# Altium project PTXC8S2.PrjPcb
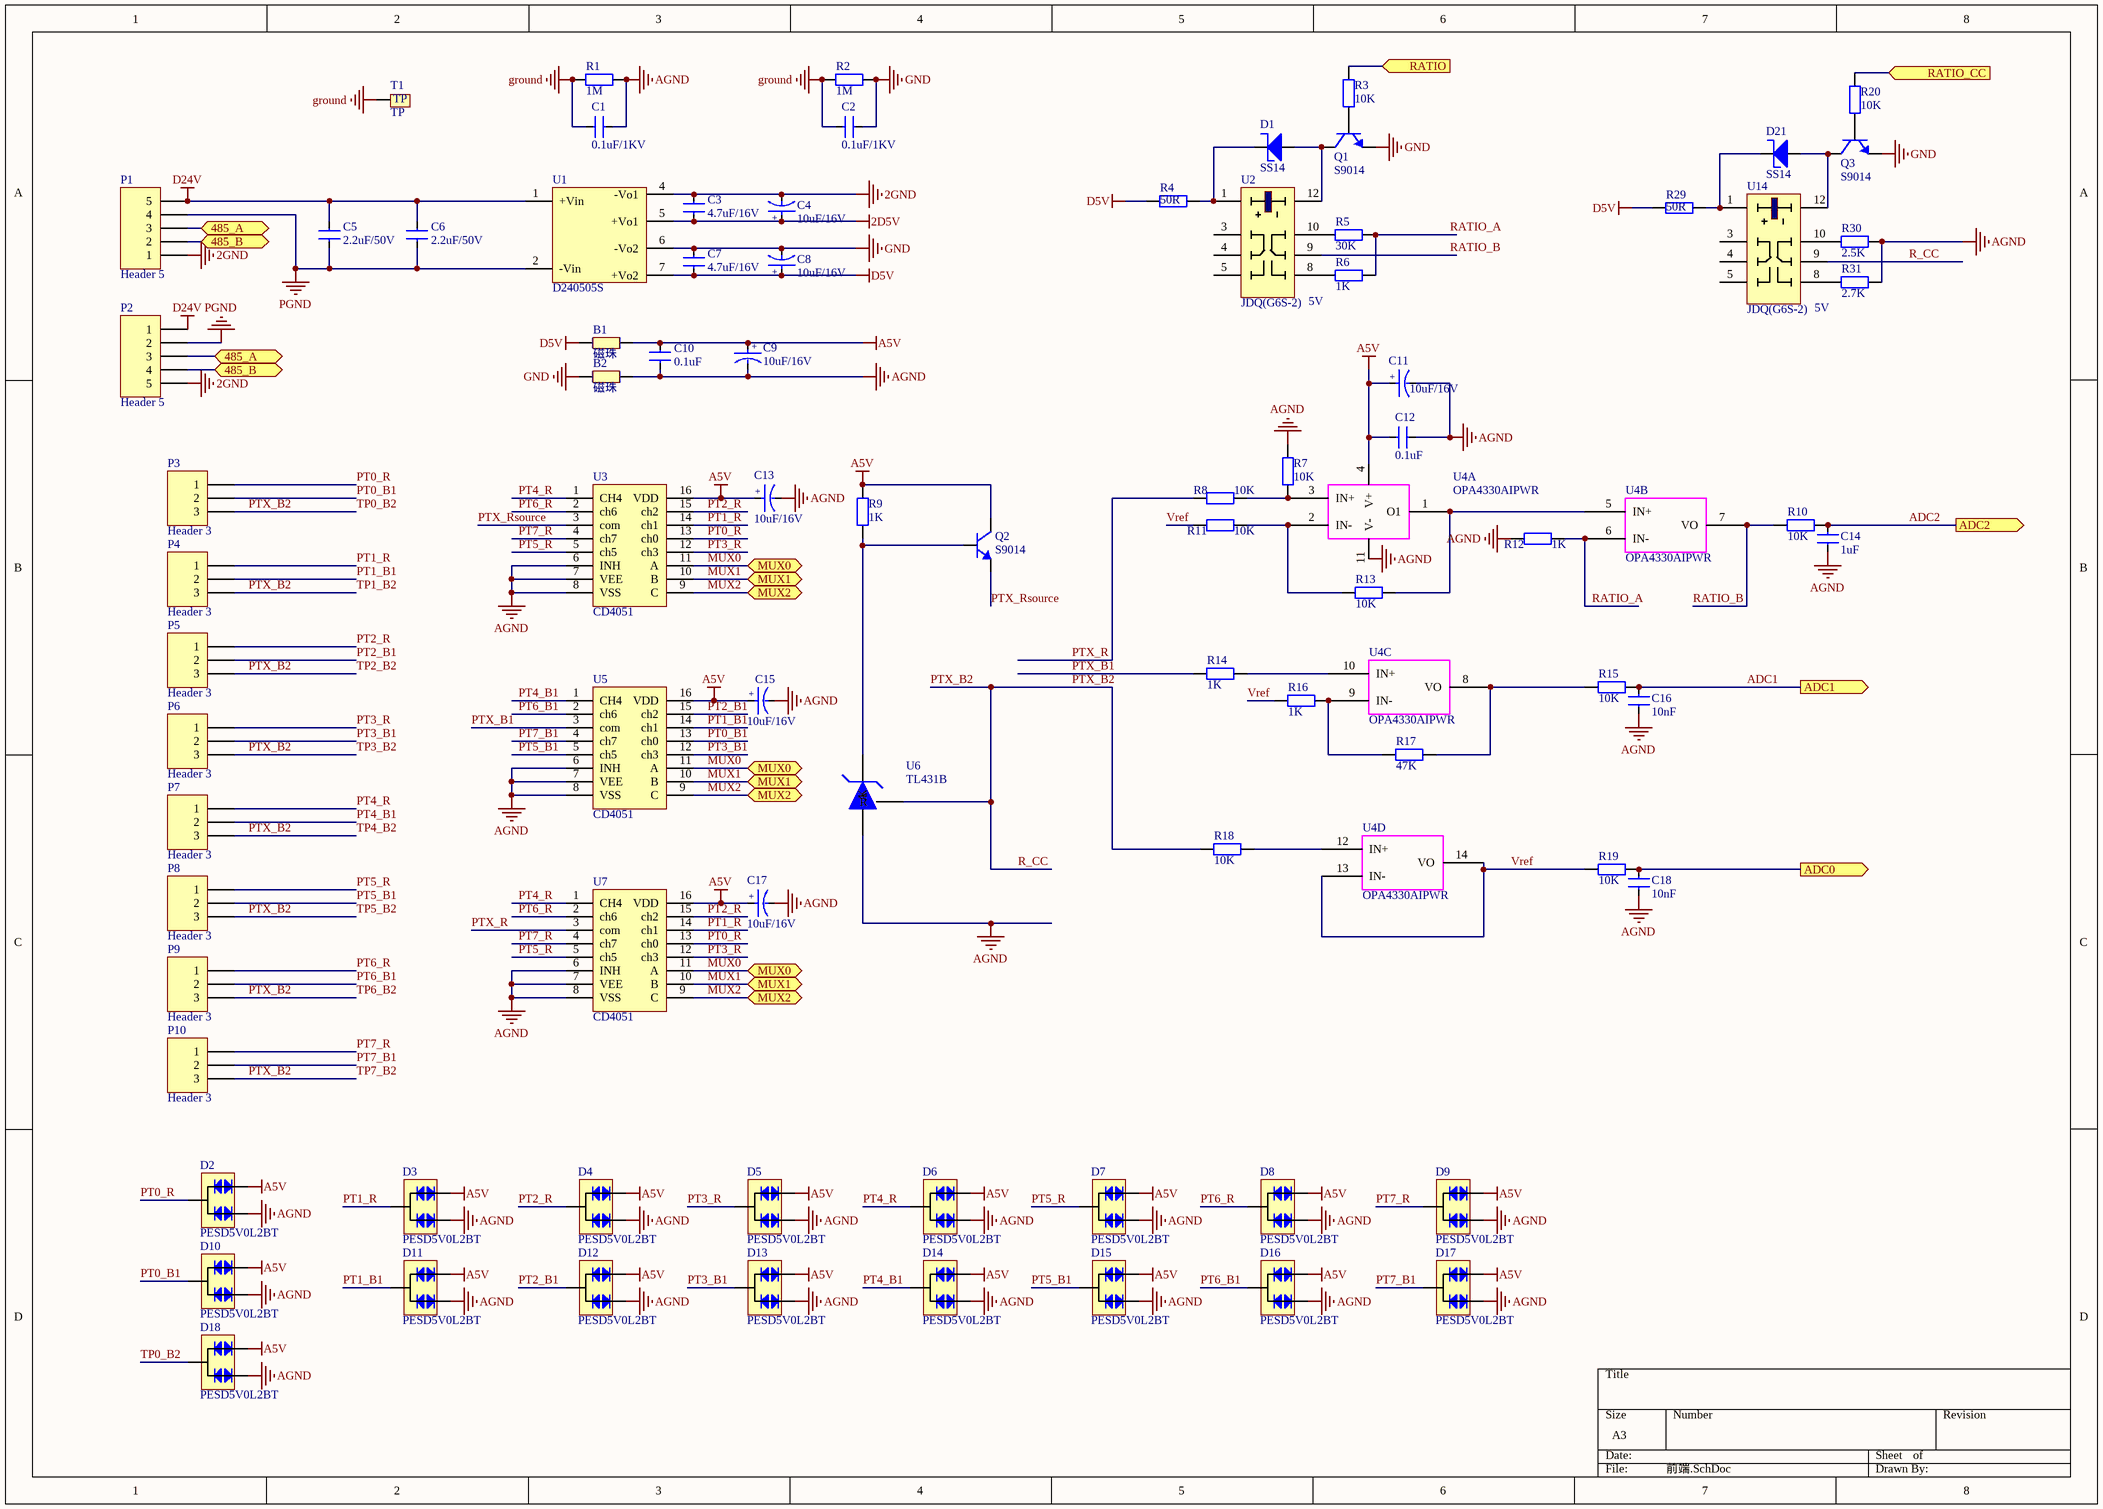
[diagram p0: 前端.SchDoc]
2 sheets, 123 parts. Net scope: flat (ports and power ports of the same name join across sheets).
Board file: PTx-V2.PcbDoc
Sheets:
  前端.SchDoc
  mcu.SchDoc

## Sheet 前端.SchDoc
size A3

### Parts
B1  磁珠  [0603L]
B2  磁珠  [0603L]
C1  0.1uF/1KV  [RAD0.2]
C2  0.1uF/1KV  [RAD0.2]
C3  4.7uF/16V  [0805C]
C4  10uF/16V  [3216C]
C5  2.2uF/50V  [0805C]
C6  2.2uF/50V  [0805C]
C7  4.7uF/16V  [0805C]
C8  10uF/16V  [3216C]
C9  10uF/16V  [3216C]
C10  0.1uF  [0603C]
C11  10uF/16V  [3216C]
C12  0.1uF  [0603C]
C13  10uF/16V  [3216C]
C14  1uF  [0603C]
C15  10uF/16V  [3216C]
C16  10nF  [0603C]
C17  10uF/16V  [3216C]
C18  10nF  [0603C]
D1  SS14  [SOD123]
D2  PESD5V0L2BT  [SOT23A]
D3  PESD5V0L2BT  [SOT23A]
D4  PESD5V0L2BT  [SOT23A]
D5  PESD5V0L2BT  [SOT23A]
D6  PESD5V0L2BT  [SOT23A]
D7  PESD5V0L2BT  [SOT23A]
D8  PESD5V0L2BT  [SOT23A]
D9  PESD5V0L2BT  [SOT23A]
D10  PESD5V0L2BT  [SOT23A]
D11  PESD5V0L2BT  [SOT23A]
D12  PESD5V0L2BT  [SOT23A]
D13  PESD5V0L2BT  [SOT23A]
D14  PESD5V0L2BT  [SOT23A]
D15  PESD5V0L2BT  [SOT23A]
D16  PESD5V0L2BT  [SOT23A]
D17  PESD5V0L2BT  [SOT23A]
D18  PESD5V0L2BT  [SOT23A]
D21  SS14  [SOD123]
P1  Header 5  [KF2DEG-3.81-5]
P2  Header 5  [KF2DEG-3.81-5]
P3  Header 3  [KF2DEG-3.81-3]
P4  Header 3  [KF2DEG-3.81-3]
P5  Header 3  [KF2DEG-3.81-3]
P6  Header 3  [KF2DEG-3.81-3]
P7  Header 3  [KF2DEG-3.81-3]
P8  Header 3  [KF2DEG-3.81-3]
P9  Header 3  [KF2DEG-3.81-3]
P10  Header 3  [KF2DEG-3.81-3]
Q1  S9014  [SOT23A]
Q2  S9014  [SOT23A]
Q3  S9014  [SOT23A]
R1  1M  [0805R]
R2  1M  [0805R]
R3  10K  [0603R]
R4  50R  [0603R]
R5  30K  [0603R]
R6  1K  [0603R]
R7  10K  [0603R]
R8  10K  [0603R]
R9  1K  [0603R]
R10  10K  [0603R]
R11  10K  [0603R]
R12  1K  [0603R]
R13  10K  [0603R]
R14  1K  [0603R]
R15  10K  [0603R]
R16  1K  [0603R]
R17  47K  [0603R]
R18  10K  [0603R]
R19  10K  [0603R]
R20  10K  [0603R]
R29  50R  [0603R]
R30  2.5K  [0603R]
R31  2.7K  [0603R]
T1  TP  [TP1]
U1  D240505S  [D240505S-2W]
U2  JDQ(G6S-2)  [JDQ-G6S-2]
U3  CD4051  [SOP16]
U4  OPA4330AIPWR  [TSSOP14-65]  (parts A,B,C,D of 4)
U5  CD4051  [SOP16]
U6  TL431B  [SOT-89]
U7  CD4051  [SOP16]
U14  JDQ(G6S-2)  [JDQ-G6S-2]

### Ports
485_A, 485_B, ADC0 (out), ADC1 (out), ADC2 (out), MUX0, MUX1, MUX2, RATIO (in), RATIO_CC (in)

### Nets
2D5V: C3.2 C4.1 U1.5(+Vo1)
2GND: C3.1 C4.2 P1.1 P2.5 U1.4(-Vo1)
A5V: B1.2 C9.1 C10.1 C11.1 C12.2 C13.1 C15.1 C17.1 D2.2 D3.2 D4.2 D5.2 D6.2 D7.2 D8.2 D9.2 D10.2 D11.2 D12.2 D13.2 D14.2 D15.2 D16.2 D17.2 D18.2 Q2.C R9.2 U3.16(VDD) U4.4(V+) U5.16(VDD) U7.16(VDD)
AGND: B2.2 C1.2 C9.2 C10.2 C11.2 C12.1 C13.2 C14.2 C15.2 C16.2 C17.2 C18.2 D2.1 D3.1 D4.1 D5.1 D6.1 D7.1 D8.1 D9.1 D10.1 D11.1 D12.1 D13.1 D14.1 D15.1 D16.1 D17.1 D18.1 R1.2 R7.1 R12.2 R30.1 R31.1 U3.6(INH) U3.7(VEE) U3.8(VSS) U4.11(V-) U5.6(INH) U5.7(VEE) U5.8(VSS) U6.2(A) U7.6(INH) U7.7(VEE) U7.8(VSS)
D5V: B1.1 C7.2 C8.1 R4.2 R29.2 U1.7(+Vo2)
D24V: C5.1 C6.1 P1.5 P2.1 U1.1(+Vin)
GND: B2.1 C2.2 C7.1 C8.2 Q1.E Q3.E R2.2 U1.6(-Vo2)
ground: C1.1 C2.1 R1.1 R2.1 T1.1
PGND: C5.2 C6.2 P1.4 P2.2 U1.2(-Vin)
485A: P1.3 P2.3 ; port 485_A
485B: P1.2 P2.4 ; port 485_B
ADC1: C16.1 R15.2 ; port ADC1
ADC2: C14.1 R10.2 ; port ADC2
MUX0: U3.11(A) U5.11(A) U7.11(A) ; port MUX0
MUX1: U3.10(B) U5.10(B) U7.10(B) ; port MUX1
MUX2: U3.9(C) U5.9(C) U7.9(C) ; port MUX2
PA7: R20.1 ; port RATIO_CC
PB10: R3.1 ; port RATIO
PT0_B1: D10.3 P3.2 U5.13(ch0)
PT0_R: D2.3 P3.1 U3.13(ch0) U7.13(ch0)
PT1_B1: D11.3 P4.2 U5.14(ch1)
PT1_R: D3.3 P4.1 U3.14(ch1) U7.14(ch1)
PT2_B1: D12.3 P5.2 U5.15(ch2)
PT2_R: D4.3 P5.1 U3.15(ch2) U7.15(ch2)
PT3_B1: D13.3 P6.2 U5.12(ch3)
PT3_R: D5.3 P6.1 U3.12(ch3) U7.12(ch3)
PT4_B1: D14.3 P7.2 U5.1(CH4)
PT4_R: D6.3 P7.1 U3.1(CH4) U7.1(CH4)
PT5_B1: D15.3 P8.2 U5.5(ch5)
PT5_R: D7.3 P8.1 U3.5(ch5) U7.5(ch5)
PT6_B1: D16.3 P9.2 U5.2(ch6)
PT6_R: D8.3 P9.1 U3.2(ch6) U7.2(ch6)
PT7_B1: D17.3 P10.2 U5.4(ch7)
PT7_R: D9.3 P10.1 U3.4(ch7) U7.4(ch7)
PTX_B1: R14.2 U5.3(com)
PTX_B2: D18.3 P3.3 P4.3 P5.3 P6.3 P7.3 P8.3 P9.3 P10.3 R18.2 U6.1(R) U14.9  [also labelled R_CC, TP0_B2, TP1_B2, TP2_B2, TP3_B2, TP4_B2, TP5_B2, TP6_B2, TP7_B2]
PTX_R: R8.2 U7.3(com)
PTX_Rsource: Q2.E U3.3(com)
RATIO_A: R5.1 R6.1 R12.1 U4.6(IN-)
RATIO_B: R10.1 U2.9 U4.7(VO)
Vref: R11.2 R16.2 R19.1 U4.13(IN-) U4.14(VO)
NetC18_1: C18.1 R19.2 ; port ADC0
NetD1_A: D1.A Q1.C U2.12
NetD1_K: D1.K R4.1 U2.1
NetD21_A: D21.A Q3.C U14.12
NetD21_K: D21.K R29.1 U14.1
NetQ1_B: Q1.B R3.2
NetQ2_B: Q2.B R9.1 U6.3(K)
NetQ3_B: Q3.B R20.2
NetR5_2: R5.2 U2.10
NetR6_2: R6.2 U2.8
NetR7_2: R7.2 R8.1 U4.3(IN+)
NetR11_1: R11.1 R13.2 U4.2(IN-)
NetR13_1: R13.1 U4.1(O1) U4.5(IN+)
NetR14_1: R14.1 U4.10(IN+)
NetR15_1: R15.1 R17.2 U4.8(VO)
NetR16_1: R16.1 R17.1 U4.9(IN-)
NetR18_1: R18.1 U4.12(IN+)
NetR30_2: R30.2 U14.10
NetR31_2: R31.2 U14.8

Not connected (* = marked no-connect by the designer): U2 3 4 5; U14 3 4 5

### Notes on the sheet
- 5V
- (in symbol CAP-T) +

### Library data of the parts
B1 B2 = BEAD
C1-C3 C5-C7 C10 C12 C14 C16 C18 = CAP: 普通小电容; 电压: 50V
C4 C8 C9 C11 C13 C15 C17 = CAP-T: 钽电容; 电压: 16V
D1 D21 = D-S: 肖特基二极管
D2-D18 = PESD5V0L2BT: schottky diod
P1 P2 = Header 5: Header, 5-Pin; LatestRevisionDate: 17-Jul-2002; LatestRevisionNote: Re-released for DXP Platform.; Publisher: Altium Limited
P3-P10 = Header 3: Header, 3-Pin; LatestRevisionDate: 17-Jul-2002; LatestRevisionNote: Re-released for DXP Platform.; Publisher: Altium Limited
Q1-Q3 = NPN: NPN三极管; pin to pad: B>1 C>3 E>2; Published: 8-Jun-2000; LatestRevisionDate: 15-Jan-2003; LatestRevisionNote: PCB Footprint 'BCY-W3/D4.7' replaced; DatasheetDocument: 1997; PackageDocument: Sep-1998; PackageReference: TO-92A; Publisher: Altium Limited; Code_JEDEC: TO-92A; ComponentLink1Description: Manufacturer Link; ComponentLink1URL: http://www.fairchildsemi.com/; ComponentLink2Description: Datasheet; ComponentLink2URL: http://www.fairchildsemi.com/ds/2N%2F2N3904.pdf
R1-R20 R29-R31 = RES: 普通电阻
T1 = TP: testpoint
U1 = D240505S-2W: 24V转双5V隔离DCDC
U2 U14 = JDQ(G6S-2): 继电器（G6S-2 5VDC）
U3 U5 U7 = CD4051: 模拟多路复用器
U4 = OPA4330: 输出轨到轨，4运放
U6 = TL431

## Sheet mcu.SchDoc
size A3
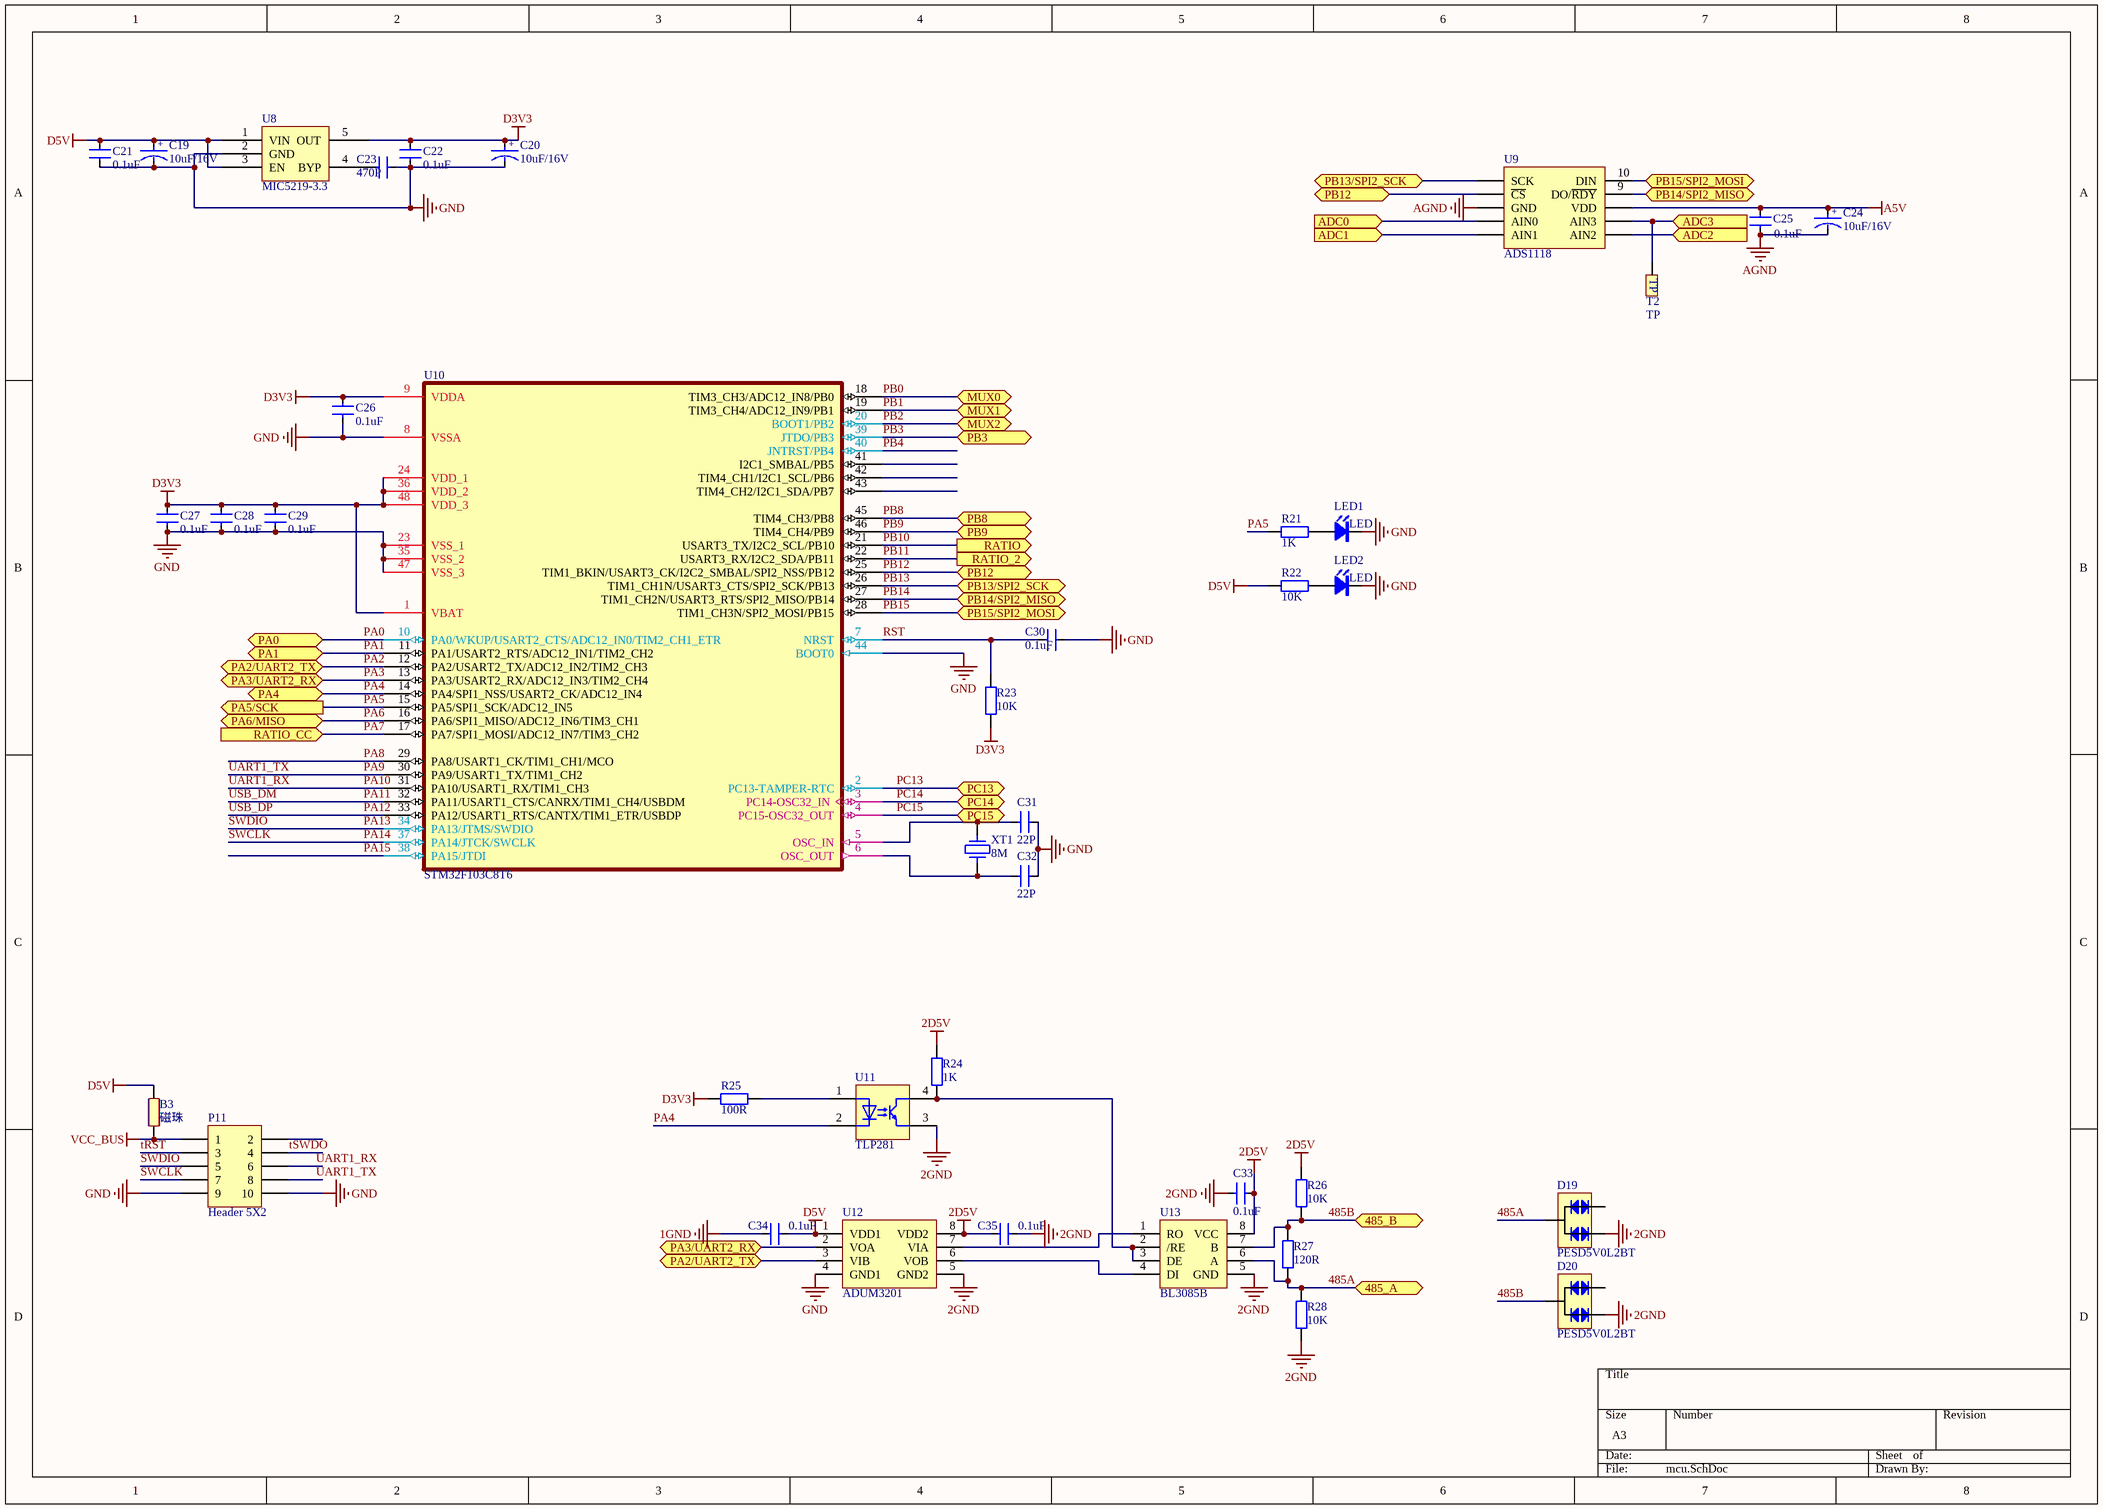
[diagram p1: mcu.SchDoc]

### Parts
B3  磁珠  [0603L]
C19  10uF/16V  [3216C]
C20  10uF/16V  [3216C]
C21  0.1uF  [0603C]
C22  0.1uF  [0603C]
C23  470P  [0603C]
C24  10uF/16V  [3216C]
C25  0.1uF  [0603C]
C26  0.1uF  [0603C]
C27  0.1uF  [0603C]
C28  0.1uF  [0603C]
C29  0.1uF  [0603C]
C30  0.1uF  [0603C]
C31  22P  [0603C]
C32  22P  [0603C]
C33  0.1uF  [0603C]
C34  0.1uF  [0603C]
C35  0.1uF  [0603C]
D19  PESD5V0L2BT  [SOT23A]
D20  PESD5V0L2BT  [SOT23A]
LED1  LED  [LED-3]
LED2  LED  [LED-3]
P11  Header 5X2  [DC2.54-10]
R21  1K  [0603R]
R22  10K  [0603R]
R23  10K  [0603R]
R24  1K  [0603R]
R25  100R  [0603R]
R26  10K  [0603R]
R27  120R  [0603R]
R28  10K  [0603R]
T2  TP  [TESTP]
U8  MIC5219-3.3  [SOT23-5]
U9  ADS1118  [TSSOP10]
U10  STM32F103C8T6  [LQFP48]
U11  TLP281  [SOP4]
U12  ADUM3201  [SOP8]
U13  BL3085B  [SOP8]
XT1  8M  [5032]

### Ports
485_A, 485_B, ADC0 (in), ADC1 (in), ADC2 (in), ADC3 (in), MUX0, MUX1, MUX2, PA0, PA1, PA2/UART2_TX, PA3/UART2_RX, PA4, PA5/SCK (out), PA6/MISO, PB3, PB8, PB9, PB12, PB13/SPI2_SCK, PB14/SPI2_MISO, PB15/SPI2_MOSI, PC13, PC14, PC15, RATIO (out), RATIO_2 (out), RATIO_CC (in)

### Nets
1GND: C34.2
2D5V: C33.2 C35.2 R24.2 R26.2 U12.8(VDD2) U13.8(VCC)
2GND: C33.1 C35.1 D19.1 D20.1 R28.1 U11.3 U12.5(GND2) U13.5(GND)
A5V: C24.1 C25.2 U9.8(VDD)
AGND: C24.2 C25.1 U9.3(GND)
D3V3: C20.1 C22.2 C26.2 C27.2 C28.1 C29.2 R23.1 R25.2 U8.5(OUT) U10.1(VBAT) U10.9(VDDA) U10.24(VDD_1) U10.36(VDD_2) U10.48(VDD_3)
D5V: B3.2 C19.1 C21.2 C34.1 R22.1 U8.1(VIN) U8.3(EN) U12.1(VDD1)
GND: C19.2 C20.2 C21.1 C22.1 C23.2 C26.1 C27.1 C28.2 C29.1 C30.2 C31.2 C32.2 LED1.K LED2.K P11.9 P11.10 U8.2(GND) U10.8(VSSA) U10.23(VSS_1) U10.35(VSS_2) U10.44(BOOT0) U10.47(VSS_3) U12.4(GND1)
VCC_BUS: B3.1 P11.1
485A: D19.3 R27.1 R28.2 U13.6(A) ; port 485_A
485B: D20.3 R26.1 R27.2 U13.7(B) ; port 485_B
ADC1: U9.5(AIN1) ; port ADC1
ADC2: U9.6(AIN2) ; port ADC2
PA0: U10.10(PA0/WKUP/USART2_CTS/ADC12_IN0/TIM2_CH1_ETR) ; port PA0
PA1: U10.11(PA1/USART2_RTS/ADC12_IN1/TIM2_CH2) ; port PA1
PA2: U10.12(PA2/USART2_TX/ADC12_IN2/TIM2_CH3) U12.3(VIB) ; port PA2/UART2_TX
PA3: U10.13(PA3/USART2_RX/ADC12_IN3/TIM2_CH4) U12.2(VOA) ; port PA3/UART2_RX
PA4: U10.14(PA4/SPI1_NSS/USART2_CK/ADC12_IN4) U11.2 ; port PA4
PA5: R21.1 U10.15(PA5/SPI1_SCK/ADC12_IN5) ; port PA5/SCK
PA6: U10.16(PA6/SPI1_MISO/ADC12_IN6/TIM3_CH1) ; port PA6/MISO
PA7: U10.17(PA7/SPI1_MOSI/ADC12_IN7/TIM3_CH2) ; port RATIO_CC
PA8: U10.29(PA8/USART1_CK/TIM1_CH1/MCO)
PA9: P11.8 U10.30(PA9/USART1_TX/TIM1_CH2)  [also labelled UART1_TX]
PA10: P11.6 U10.31(PA10/USART1_RX/TIM1_CH3)  [also labelled UART1_RX]
PA11: U10.32(PA11/USART1_CTS/CANRX/TIM1_CH4/USBDM)  [also labelled USB_DM]
PA12: U10.33(PA12/USART1_RTS/CANTX/TIM1_ETR/USBDP)  [also labelled USB_DP]
PA13: P11.5 U10.34(PA13/JTMS/SWDIO)  [also labelled SWDIO]
PA14: P11.7 U10.37(PA14/JTCK/SWCLK)  [also labelled SWCLK]
PA15: U10.38(PA15/JTDI)
PB0: U10.18(TIM3_CH3/ADC12_IN8/PB0) ; port MUX0  [project net MUX0]
PB1: U10.19(TIM3_CH4/ADC12_IN9/PB1) ; port MUX1  [project net MUX1]
PB2: U10.20(BOOT1/PB2) ; port MUX2  [project net MUX2]
PB3: U10.39(JTDO/PB3) ; port PB3
PB4: U10.40(JNTRST/PB4)
PB8: U10.45(TIM4_CH3/PB8) ; port PB8
PB9: U10.46(TIM4_CH4/PB9) ; port PB9
PB10: U10.21(USART3_TX/I2C2_SCL/PB10) ; port RATIO
PB11: U10.22(USART3_RX/I2C2_SDA/PB11) ; port RATIO_2
PB12: U9.2(~{CS}) U10.25(TIM1_BKIN/USART3_CK/I2C2_SMBAL/SPI2_NSS/PB12) ; port PB12
PB13: U9.1(SCK) U10.26(TIM1_CH1N/USART3_CTS/SPI2_SCK/PB13) ; port PB13/SPI2_SCK
PB14: U9.9(DO/~{RDY}) U10.27(TIM1_CH2N/USART3_RTS/SPI2_MISO/PB14) ; port PB14/SPI2_MISO
PB15: U9.10(DIN) U10.28(TIM1_CH3N/SPI2_MOSI/PB15) ; port PB15/SPI2_MOSI
PC13: U10.2(PC13-TAMPER-RTC) ; port PC13
PC14: U10.3(PC14-OSC32_IN) ; port PC14
PC15: U10.4(PC15-OSC32_OUT) ; port PC15
RST: C30.1 R23.2 U10.7(NRST)
tRST: P11.3
tSWDO: P11.4
NetC18_1: U9.4(AIN0) ; port ADC0
NetC23_1: C23.1 U8.4(BYP)
NetC31_1: C31.1 U10.5(OSC_IN) XT1.1
NetC32_1: C32.1 U10.6(OSC_OUT) XT1.2
NetLED1_A: LED1.A R21.2
NetLED2_A: LED2.A R22.2
NetR24_1: R24.1 U11.4 U13.2(/RE) U13.3(DE)
NetR25_1: R25.1 U11.1
NetT2_1: T2.1 U9.7(AIN3) ; port ADC3
NetU12_6: U12.6(VOB) U13.4(DI)
NetU12_7: U12.7(VIA) U13.1(RO)

Not connected (* = marked no-connect by the designer): D19 2; D20 2; P11 2; U10 41(I2C1_SMBAL/PB5) 42(TIM4_CH1/I2C1_SCL/PB6) 43(TIM4_CH2/I2C1_SDA/PB7)

### Notes on the sheet
- Labels drawn without touching a wire or pin: ENC1, ENC2, ENC3
- (in symbol CAP-T) +

### Library data of the parts
B3 = BEAD
C19 C20 C24 = CAP-T: 钽电容; 电压: 16V
C21 C22 C25 = CAP: 普通小电容; 电压: 50V
C23 C26-C35 = CAP: 普通小电容
D19 D20 = PESD5V0L2BT: schottky diod
P11 = Header 5X2: Header, 5-Pin, Dual row; LatestRevisionDate: 17-Jul-2002; LatestRevisionNote: Re-released for DXP Platform.; Publisher: Altium Limited
R21-R28 = RES: 普通电阻
T2 = TP: testpoint
U8 = MIC5219
U9 = ADS1118: 16λ ADC
U10 = STM32F103
U11 = TLP281: TLP281 光耦
U13 = BL3085B: BL3085B 15KV防静电485
XT1 = XT: 晶振

## Nets that join several sheets
2D5V: 前端 (C3.2 C4.1 U1.5), mcu (6 pins)
2GND: 前端 (5 pins), mcu (8 pins)
A5V: 前端 (31 pins), mcu (C24.1 C25.2 U9.8)
AGND: 前端 (45 pins), mcu (C24.2 C25.1 U9.3)
D5V: 前端 (6 pins), mcu (8 pins)
GND: 前端 (8 pins), mcu (23 pins)
485A: 前端 (P1.3 P2.3), mcu (D19.3 R27.1 R28.2 U13.6)
485B: 前端 (P1.2 P2.4), mcu (D20.3 R26.1 R27.2 U13.7)
ADC1: 前端 (C16.1 R15.2), mcu (U9.5)
ADC2: 前端 (C14.1 R10.2), mcu (U9.6)
MUX0: 前端 (U3.11 U5.11 U7.11), mcu (U10.18)
MUX1: 前端 (U3.10 U5.10 U7.10), mcu (U10.19)
MUX2: 前端 (U3.9 U5.9 U7.9), mcu (U10.20)
NetC18_1: 前端 (C18.1 R19.2), mcu (U9.4)
PA7: 前端 (R20.1), mcu (U10.17)
PB10: 前端 (R3.1), mcu (U10.21)